# EAGLE design myDuinoMini_v1.0 (EAGLE 6.5.0)
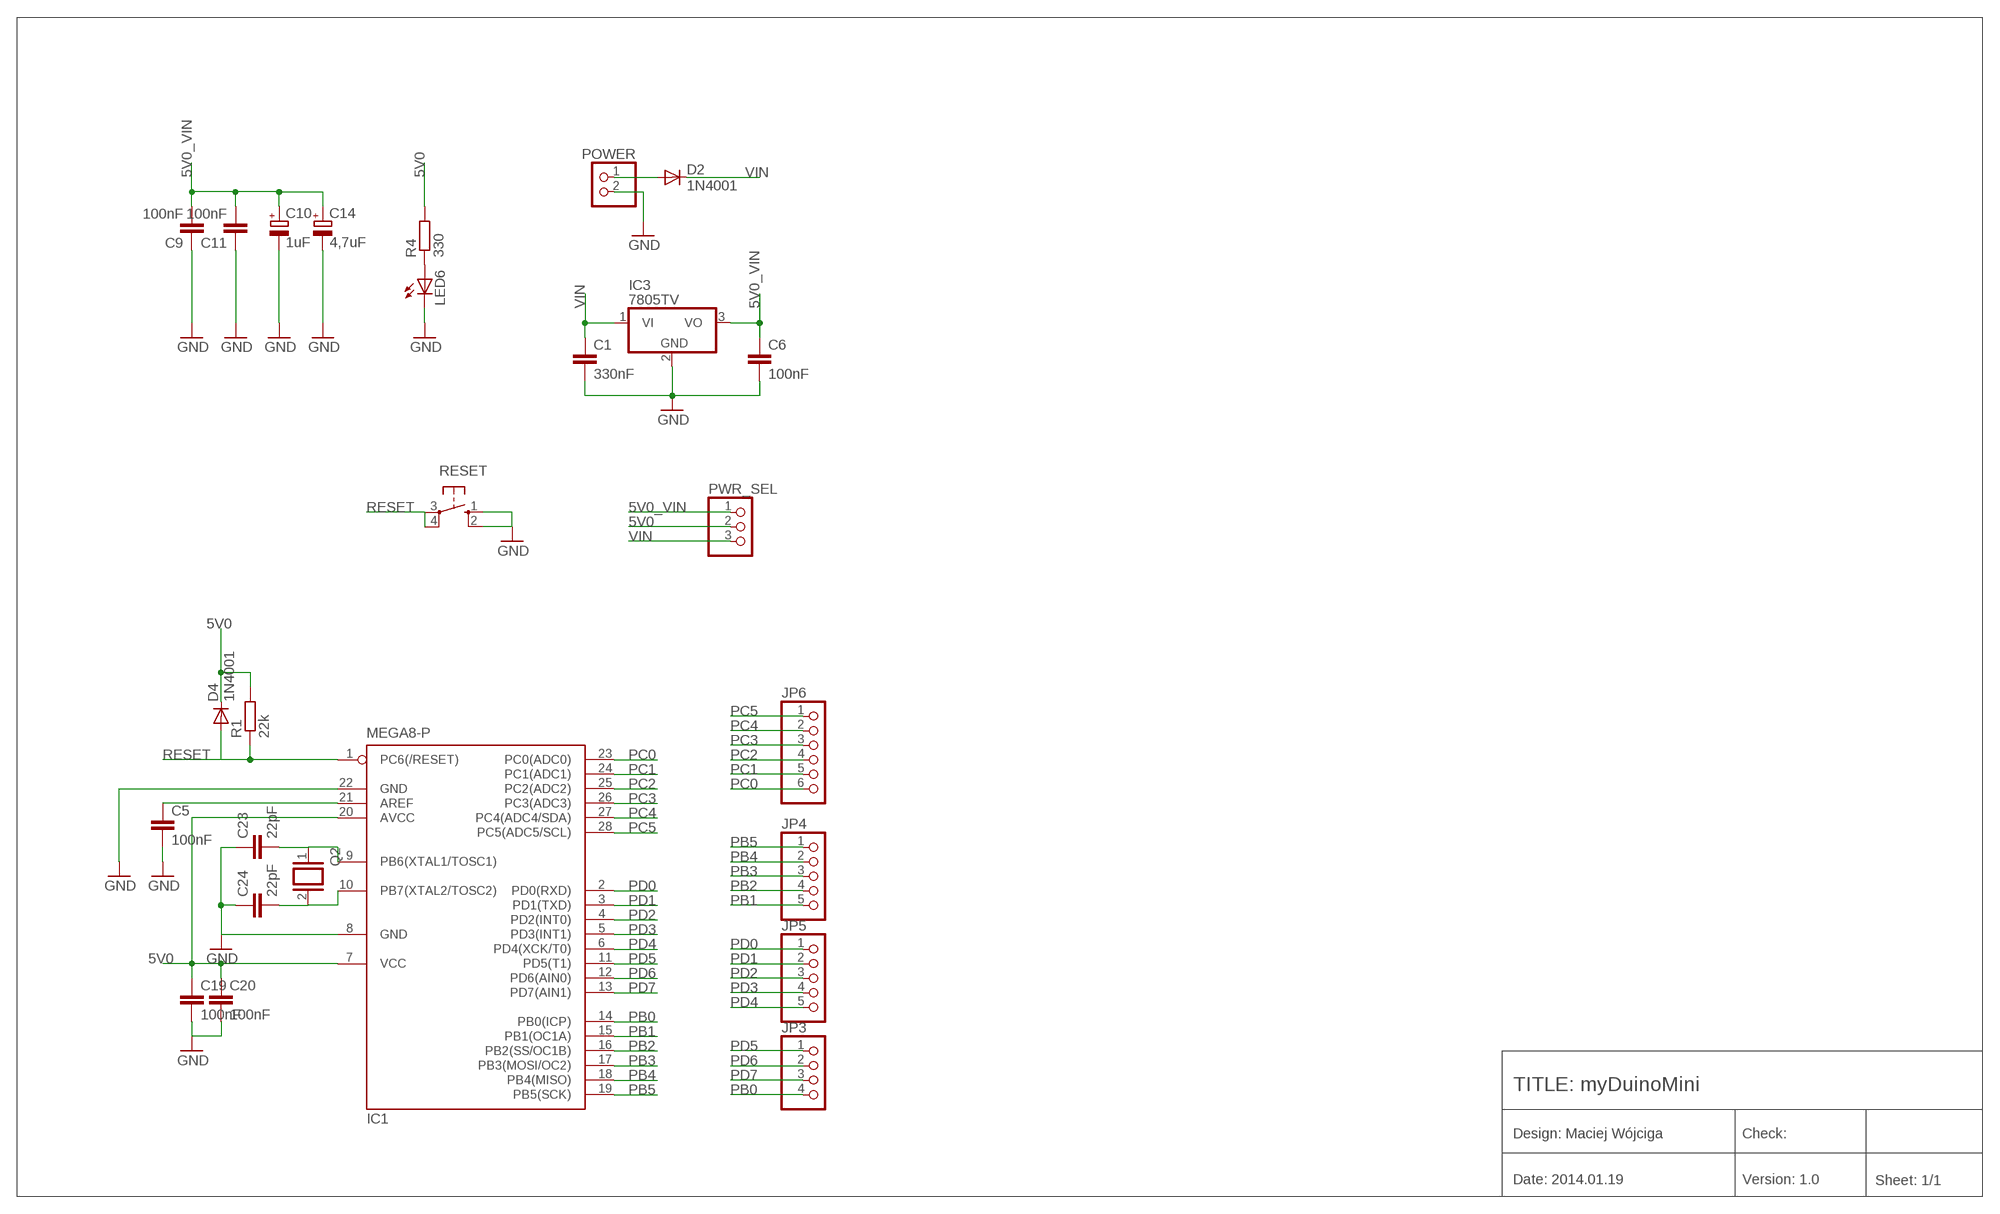
[diagram p0: schematic, sheet 1]

## Parts
C1  330nF  C-EU025-025X050  [C025-025X050]
C5  100nF  C-EU025-025X050  [C025-025X050]
C6  100nF  C-EU025-025X050  [C025-025X050]
C9  100nF  C-EU025-025X050  [C025-025X050]
C10  1uF  CPOL-EUE2.5-5  [E2,5-5]
C11  100nF  C-EU025-025X050  [C025-025X050]
C14  4,7uF  CPOL-EUE2.5-5  [E2,5-5]
C19  100nF  C-EU025-025X050  [C025-025X050]
C20  100nF  C-EU025-025X050  [C025-025X050]
C23  22pF  C-EU025-025X050  [C025-025X050]
C24  22pF  C-EU025-025X050  [C025-025X050]
D2  1N4001  1N4004  [DO41-10]
D4  1N4001  1N4004  [DO41-10]
IC1  MEGA8-P  [DIL28-3]
IC3  7805TV  [TO220V]
JP3  PINHD-1X4  [1X04]
JP4  PINHD-1X5  [1X05]
JP5  PINHD-1X5  [1X05]
JP6  PINHD-1X6  [1X06]
LED6  LED3MM  [LED3MM]
POWER  PINHD-1X2  [1X02]
PWR_SEL  PINHD-1X3  [1X03]
Q2  XTAL/S  [QS]
R1  22k  R-EU_0207/10  [0207/10]
R4  330  R-EU_0207/10  [0207/10]
RESET  10-XX  [B3F-10XX]

## Nets
5V0: C19.1 C20.1 D4.C IC1.7(VCC) IC1.20(AVCC) PWR_SEL.2 R1.2 R4.2
5V0_VIN: C6.1 C9.2 C10.+ C11.2 C14.+ IC3.3(VO) PWR_SEL.1
GND: C1.2 C5.2 C6.2 C9.1 C10.- C11.1 C14.- C19.2 C20.2 C23.1 C24.1 IC1.8(GND) IC1.22(GND) IC3.2(GND) LED6.K(C) POWER.2 RESET.1(S) RESET.2(S1)
N$3: LED6.A R4.1
N$4: D2.A POWER.1
N$26: C5.1 IC1.21(AREF)
N$29: C23.2 IC1.9(PB6(XTAL1/TOSC1)) Q2.1
N$35: C24.2 IC1.10(PB7(XTAL2/TOSC2)) Q2.2
PB0: IC1.14(PB0(ICP)) JP3.4
PB1: IC1.15(PB1(OC1A)) JP4.5
PB2: IC1.16(PB2(SS/OC1B)) JP4.4
PB3: IC1.17(PB3(MOSI/OC2)) JP4.3
PB4: IC1.18(PB4(MISO)) JP4.2
PB5: IC1.19(PB5(SCK)) JP4.1
PC0: IC1.23(PC0(ADC0)) JP6.6
PC1: IC1.24(PC1(ADC1)) JP6.5
PC2: IC1.25(PC2(ADC2)) JP6.4
PC3: IC1.26(PC3(ADC3)) JP6.3
PC4: IC1.27(PC4(ADC4/SDA)) JP6.2
PC5: IC1.28(PC5(ADC5/SCL)) JP6.1
PD0: IC1.2(PD0(RXD)) JP5.1
PD1: IC1.3(PD1(TXD)) JP5.2
PD2: IC1.4(PD2(INT0)) JP5.3
PD3: IC1.5(PD3(INT1)) JP5.4
PD4: IC1.6(PD4(XCK/T0)) JP5.5
PD5: IC1.11(PD5(T1)) JP3.1
PD6: IC1.12(PD6(AIN0)) JP3.2
PD7: IC1.13(PD7(AIN1)) JP3.3
RESET: D4.A IC1.1(PC6(/RESET)) R1.1 RESET.3(P) RESET.4(P1)
VIN: C1.1 D2.C IC3.1(VI) PWR_SEL.3

## Notes on the sheet
- TITLE: myDuinoMini
- Design: Maciej Wójciga | Check:
- Date: 2014.01.19 | Version: 1.0 | Sheet: 1/1

## Library data of the parts
C1 C5 C6 C9 C11 C19 C20 C23 C24 = rcl:C-EU: CAPACITOR, European symbol
C10 C14 = rcl:CPOL-EU: POLARIZED CAPACITOR, European symbol
D2 D4 = diode:1N4004: DIODE general purpose rectifier, 1 A
IC1 = atmel:MEGA8-P: MICROCONTROLLER 8 Kbytes FLASH, 1 kbytes SRAM, 512 bytes EEPROM, USART, 4-channel 10 bit ADC, 2-channel 8 bit ADC Pin compatible with Atmega48, ATMega88, ATMega168 Source: avr.lbr; OC_FARNELL: unknown; OC_NEWARK: unknown
IC3 = linear:78*: Positive VOLTAGE REGULATOR Source: http://cache.national.com/ds/LM/LM78L05.pdf http://www.fairchildsemi.com/ds/LM/LM7805.pdf
JP3 = pinhead:PINHD-1X4: PIN HEADER
JP4 JP5 = pinhead:PINHD-1X5: PIN HEADER
JP6 = pinhead:PINHD-1X6: PIN HEADER
LED6 = led:LED: LED OSRAM: - CHIPLED LG R971, LG N971, LY N971, LG Q971, LY Q971, LO R971, LY R971 LH N974, LH R974 LS Q976, LO Q976, LY Q976 LO Q996 - Hyper CHIPLED LW Q18S LB Q993, LB Q99A, LB R99A - SideLED LS A670, LO A670, LY A670, LG A670, LP A670 LB A673, LV A673, LT A673, LW A673 LH A674 LY A675 LS A676, LA A676, LO A676, LY A676, LW A676 LS A679, LY A679, LG A679 - Hyper Micro SIDELED® LS Y876, LA Y876, LO Y876, LY Y876 LT Y87S - SmartLED LW L88C, LW L88S LB L89C, LB L89S, LG L890 LS L89K, LO L89K, LY L89K LS L896, LA L896, LO L896, LY L896 - TOPLED LS T670, LO T670, LY T670, LG T670, LP T670 LSG T670, LSP T670, LSY T670, LOP T670, LYG T670 LG T671, LOG T671, LSG T671 LB T673, LV T673, LT T673, LW T673 LH T674 LS T676, LA T676, LO T676, LY T676, LB T676, LH T676, LSB T676, LW T676 LB T67C, LV T67C, LT T67C, LS T67K, LO T67K, LY T67K, LW E67C LS E67B, LA E67B, LO E67B, LY E67B, LB E67C, LV E67C, LT E67C LW T67C LS T679, LY T679, LG T679 LS T770, LO T770, LY T770, LG T770, LP T770 LB T773, LV T773, LT T773, LW T773 LH T774 LS E675, LA E675, LY E675, LS T675 LS T776, LA T776, LO T776, LY T776, LB T776 LHGB T686 LT T68C, LB T68C - Hyper Mini TOPLED® LB M676 - Mini TOPLED Santana® LG M470 LS M47K, LO M47K, LY M47K Source: http://www.osram.convergy.de LUXEON: - LUMILED® LXK2-PW12-R00, LXK2-PW12-S00, LXK2-PW14-U00, LXK2-PW14-V00 LXK2-PM12-R00, LXK2-PM12-S00, LXK2-PM14-U00 LXK2-PE12-Q00, LXK2-PE12-R00, LXK2-PE12-S00, LXK2-PE14-T00, LXK2-PE14-U00 LXK2-PB12-K00, LXK2-PB12-L00, LXK2-PB12-M00, LXK2-PB14-N00, LXK2-PB14-P00, LXK2-PB14-Q00 LXK2-PR12-L00, LXK2-PR12-M00, LXK2-PR14-Q00, LXK2-PR14-R00 LXK2-PD12-Q00, LXK2-PD12-R00, LXK2-PD12-S00 LXK2-PH12-R00, LXK2-PH12-S00 LXK2-PL12-P00, LXK2-PL12-Q00, LXK2-PL12-R00 Source: www.luxeon.com KINGBRIGHT: KA-3528ASYC Source: www.kingbright.com
POWER = pinhead:PINHD-1X2: PIN HEADER
PWR_SEL = pinhead:PINHD-1X3: PIN HEADER
Q2 = special:XTAL/S: CRYSTAL
R1 R4 = rcl:R-EU_: RESISTOR, European symbol
RESET = switch-omron:10-XX: OMRON SWITCH; MPN: B3F-1000; OC_FARNELL: 176432; OC_NEWARK: 36M3542

## Net classes
0 default: width 0.203 mm

## Board
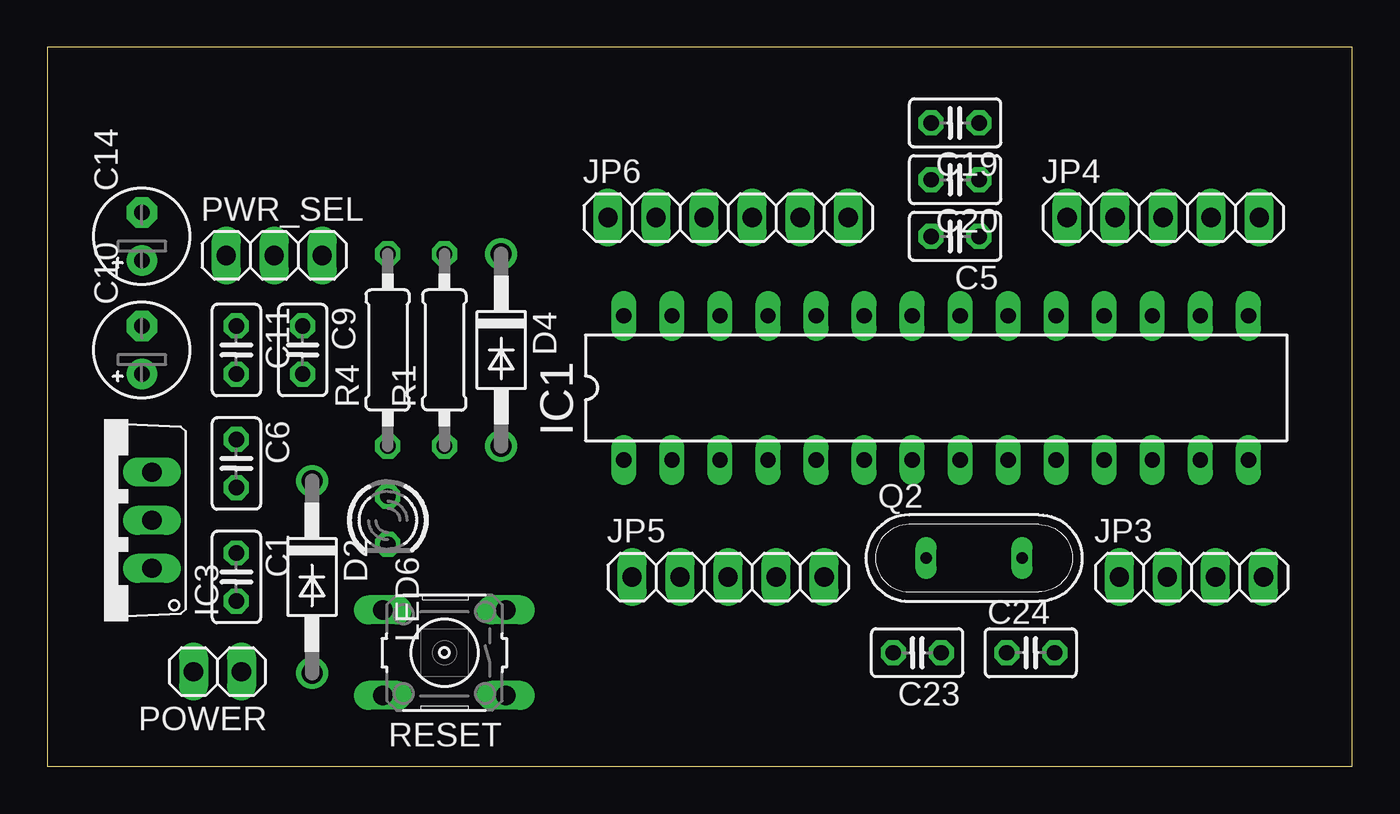
[diagram p1: board, top side]
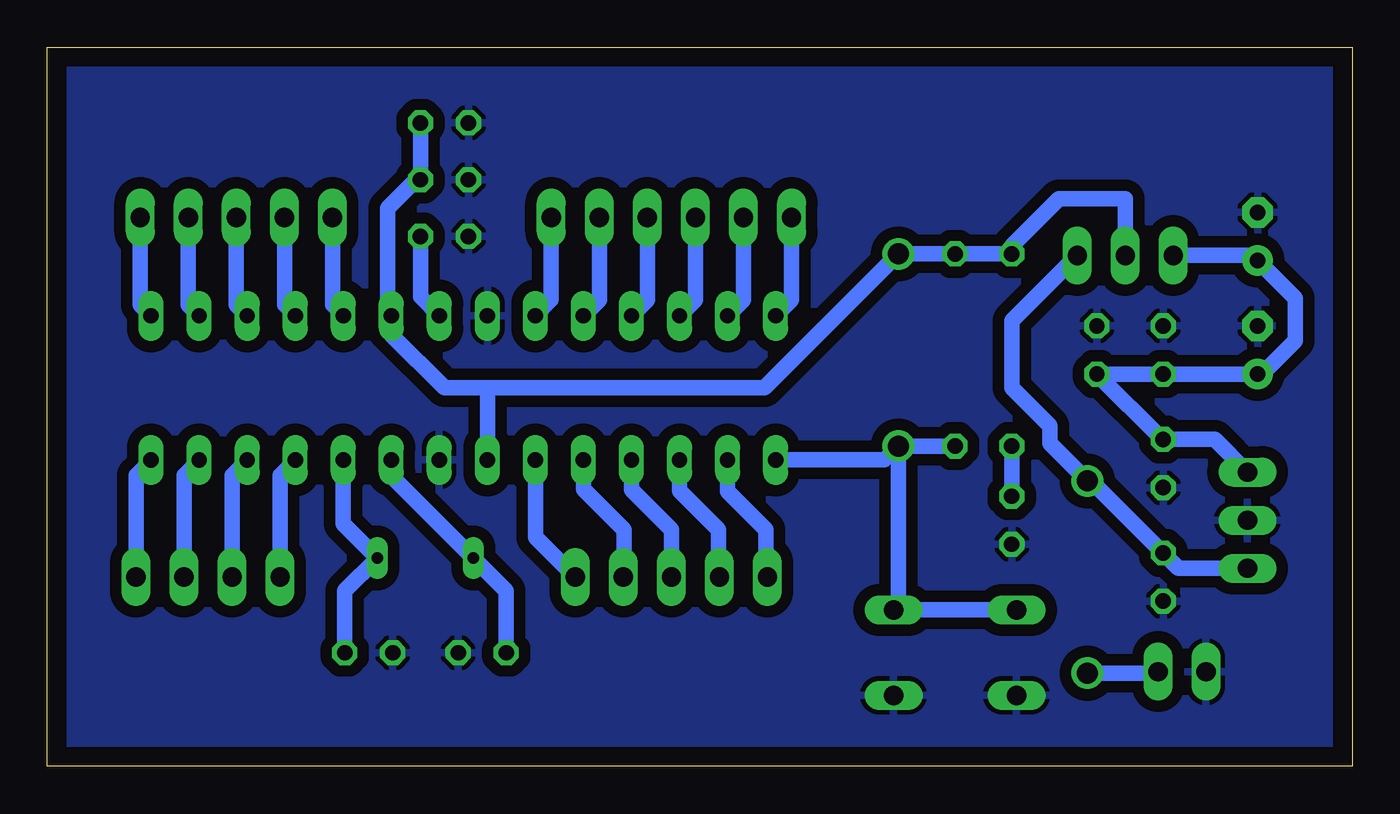
[diagram p2: board, bottom side, seen from below]

Size 69 x 38 mm. Coordinates in mm from the lower left corner, seen from the top.
Outline: 0,0 69,0 69,38 0,38 0,0
Copper layers (1*16): Top 0.035mm / dielectric 1.5mm / Bottom 0.035mm
Design rules "default": minimum track width 10mil, minimum drill 24mil, track to track 8mil, track to pad 8mil, pad to pad 8mil, via to via 8mil, smd to smd 8mil, copper to edge 40mil, drill to drill 8mil, minimum pad ring 10mil, minimum via ring 8mil, stop-mask expansion 4mil, vias tented up to drill 0mil, thermal gap 10mil

### Footprints (pad centres in the part's own frame; a part is rotated, then mirrored left to right if it is on the bottom)
C025-025X050 = drill 0.813 octagon: 1 -1.27,0; 2 1.27,0
E2,5-5 = drill 0.813 pad 1.6: + -1.27,0 | drill 0.813 pad 1.6 octagon: - 1.27,0
DO41-10 = drill 1.118: A 5.08,0; C -5.08,0
DIL28-3 = drill 0.813 long: 1 -16.51,-3.81; 2 -13.97,-3.81; 3 -11.43,-3.81; 4 -8.89,-3.81; 5 -6.35,-3.81; 6 -3.81,-3.81; 7 -1.27,-3.81; 8 1.27,-3.81; 9 3.81,-3.81; 10 6.35,-3.81; 11 8.89,-3.81; 12 11.43,-3.81; 13 13.97,-3.81; 14 16.51,-3.81; 15 16.51,3.81; 16 13.97,3.81; 17 11.43,3.81; 18 8.89,3.81; 19 6.35,3.81; 20 3.81,3.81; 21 1.27,3.81; 22 -1.27,3.81; 23 -3.81,3.81; 24 -6.35,3.81; 25 -8.89,3.81; 26 -11.43,3.81; 27 -13.97,3.81; 28 -16.51,3.81
TO220V = drill 1.016 long: 1 -2.54,-2.54; 2 0,-2.54; 3 2.54,-2.54
1X04 = drill 1.016 long: 1 -3.81,0; 2 -1.27,0; 3 1.27,0; 4 3.81,0
1X05 = drill 1.016 long: 1 -5.08,0; 2 -2.54,0; 3 0,0; 4 2.54,0; 5 5.08,0
1X06 = drill 1.016 long: 1 -6.35,0; 2 -3.81,0; 3 -1.27,0; 4 1.27,0; 5 3.81,0; 6 6.35,0
LED3MM = drill 0.813 octagon: A -1.27,0; K 1.27,0
1X02 = drill 1.016 long: 1 -1.27,0; 2 1.27,0
1X03 = drill 1.016 long: 1 -2.54,0; 2 0,0; 3 2.54,0
QS = drill 0.61 long: 1 -2.54,0; 2 2.54,0
0207/10 = drill 0.813 octagon: 1 -5.08,0; 2 5.08,0
B3F-10XX = drill 1.016 long: 1 -3.251,2.261; 2 3.251,2.261; 3 -3.251,-2.261; 4 3.251,-2.261

### Placement (x,y rotation side)
C1  10,10 270 top
C5  48,28 180 top
C6  10,16 270 top
C9  13.5,22 270 top
C10  5,22 90 top
C11  10,22 270 top
C14  5,28 90 top
C19  48,34 180 top
C20  48,31 180 top
C23  46,6 180 top
C24  52,6 0 top
D2  14,10 270 top
D4  24,22 270 top
IC1  47,20 0 top
IC3  3,13 90 top
JP3  60.5,10 0 top
JP4  59,29 0 top
JP5  36,10 0 top
JP6  36,29 0 top
LED6  18,13 270 top
POWER  9,5 180 top
PWR_SEL  12,27 0 top
Q2  49,11 0 top
R1  21,22 90 top
R4  18,22 90 top
RESET  21,6 180 top

### Tracks (layer width: path | path; a pad name or v marks a point on that pad's centre or on a via)
5V0
  Bottom 0.813: C19.1 C20.1 49.5,31 51,29.5 51,24 IC1.20 50.81,22.81 48,20 46,20 45.73,20 | PWR_SEL.2 12,30 15.5,30 18,27.5 R4.2 R1.2 D4.C 31.08,20 45.73,20 | IC1.7 45.73,20
5V0_VIN
  Bottom 0.813: IC3.3 7.27,17.27 C6.1 10.04,17.27 C9.2 C11.2 C10.+ 4.77,20.73 3,22.5 3,24.73 C14.+ 5.27,27 PWR_SEL.1
GND
  pour Bottom (isolate 0.61): 0,38 69,38 69,0 0,0
N$3
  Bottom 0.813: R4.1 LED6.A
N$4
  Bottom 0.813: POWER.1 10.35,4.92 D2.A
N$26
  Bottom 0.813: IC1.21 49.27,24.81 C5.1
N$29
  Bottom 0.813: IC1.9 50.81,15.35 Q2.1 44.73,9.27 C23.2
N$35
  Bottom 0.813: IC1.10 53.35,12.81 Q2.2 53.27,9.27 C24.2
PB0
  Bottom 0.813: JP3.4 64.31,15.39 IC1.14
PB1
  Bottom 0.813: JP4.5 64.08,24.38 IC1.15
PB2
  Bottom 0.813: JP4.4 61.54,24.38 IC1.16
PB3
  Bottom 0.813: JP4.3 59,24.38 IC1.17
PB4
  Bottom 0.813: JP4.2 56.46,24.38 IC1.18
PB5
  Bottom 0.813: JP4.1 53.92,24.38 IC1.19
PC0
  Bottom 0.813: JP6.6 42.35,24.65 IC1.23
PC1
  Bottom 0.813: JP6.5 39.81,24.65 IC1.24
PC2
  Bottom 0.813: JP6.4 37.27,24.65 IC1.25
PC3
  Bottom 0.813: JP6.3 34.73,24.65 IC1.26
PC4
  Bottom 0.813: JP6.2 32.19,24.65 IC1.27
PC5
  Bottom 0.813: JP6.1 29.65,24.65 IC1.28
PD0
  Bottom 0.813: IC1.2 33.03,14.53 31,12.5 31,10.08 JP5.1
PD1
  Bottom 0.813: IC1.3 35.57,14.57 33.5,12.5 33.5,10.04 JP5.2
PD2
  Bottom 0.813: IC1.4 38.11,14.61 36,12.5 JP5.3
PD3
  Bottom 0.813: IC1.5 40.65,14.65 38.5,12.5 38.5,10.04 JP5.4
PD4
  Bottom 0.813: IC1.6 43.19,12.11 JP5.5
PD5
  Bottom 0.813: IC1.11 56.69,15.39 JP3.1
PD6
  Bottom 0.813: IC1.12 59.23,15.39 JP3.2
PD7
  Bottom 0.813: IC1.13 61.77,15.39 JP3.3
RESET
  Bottom 0.813: IC1.1 24.73,16.19 D4.A | D4.A R1.1 | RESET.3 24,8.51 | 24,8.51 D4.A | 24,8.51 23.75,8.26 RESET.4
VIN
  Bottom 0.813: IC3.1 9.19,10.46 C1.1 13.81,15.08 D2.C 16,17.08 16,18 18,20 18,23.54 PWR_SEL.3